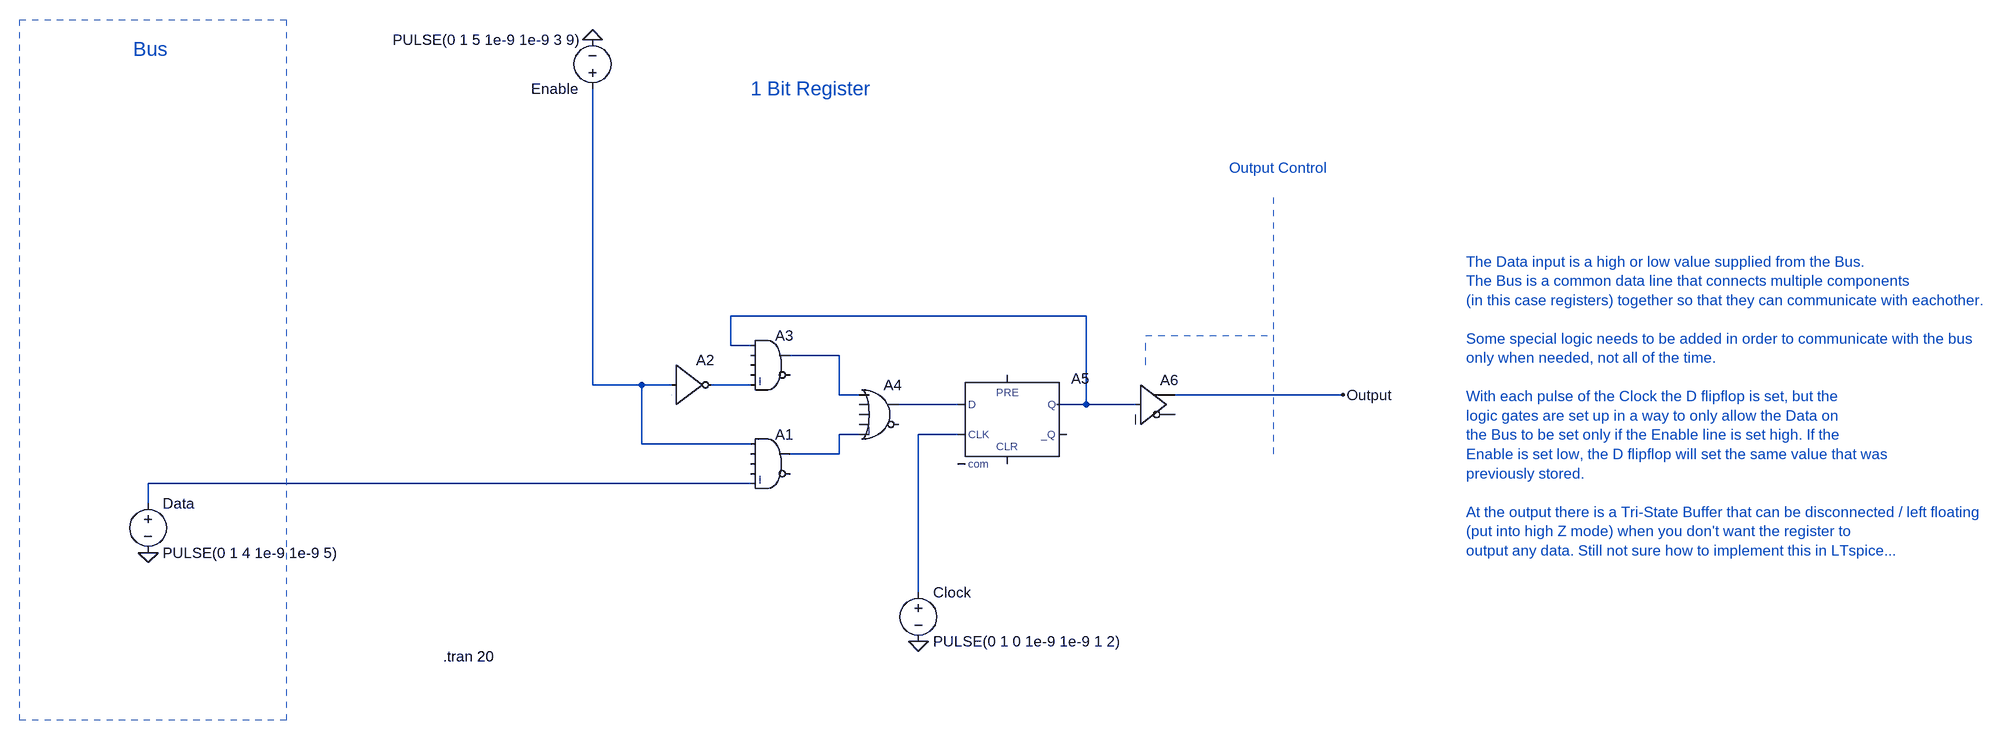
[diagram p0: schematic 1 Bit Register.asc]
1 Bit Register.asc, the LTspice schematic file:
Version 4
SHEET 1 3200 680
WIRE 976 -176 400 -176
WIRE 400 -128 400 -176
WIRE 432 -128 400 -128
WIRE 576 -112 496 -112
WIRE 176 -64 176 -544
WIRE 256 -64 176 -64
WIRE 304 -64 256 -64
WIRE 432 -64 368 -64
WIRE 576 -48 576 -112
WIRE 608 -48 576 -48
WIRE 1392 -48 1120 -48
WIRE 768 -32 672 -32
WIRE 976 -32 976 -176
WIRE 976 -32 928 -32
WIRE 1056 -32 976 -32
WIRE 608 16 576 16
WIRE 768 16 704 16
WIRE 256 32 256 -64
WIRE 432 32 256 32
WIRE 576 48 576 16
WIRE 576 48 496 48
WIRE 432 96 -544 96
WIRE -544 128 -544 96
WIRE 704 272 704 16
FLAG -544 208 0
FLAG 704 352 0
FLAG 176 -624 0
FLAG 1392 -48 Output
SYMBOL voltage -544 112 R0
WINDOW 123 0 0 Left 0
WINDOW 39 0 0 Left 0
SYMATTR InstName Data
SYMATTR Value PULSE(0 1 4 1e-9 1e-9 5)
SYMBOL voltage 176 -528 R180
WINDOW 123 0 0 Left 0
WINDOW 39 0 0 Left 0
SYMATTR InstName Enable
SYMATTR Value PULSE(0 1 5 1e-9 1e-9 3 9)
SYMBOL Digital\\and 464 0 R0
SYMATTR InstName A1
SYMBOL Digital\\inv 304 -128 R0
SYMATTR InstName A2
SYMBOL Digital\\and 464 -160 R0
SYMATTR InstName A3
SYMBOL Digital\\or 640 -80 R0
SYMATTR InstName A4
SYMBOL Digital\\dflop 848 -80 R0
SYMATTR InstName A5
SYMBOL voltage 704 256 R0
WINDOW 123 0 0 Left 0
WINDOW 39 0 0 Left 0
SYMATTR InstName Clock
SYMATTR Value PULSE(0 1 0 1e-9 1e-9 1 2)
SYMBOL Digital\\buf 1056 -96 R0
SYMATTR InstName A6
TEXT -66 376 Left 2 !.tran 20
TEXT 432 -544 Left 3 ;1 Bit Register
TEXT 1592 -264 Left 2 ;The Data input is a high or low value supplied from the Bus.\nThe Bus is a common data line that connects multiple components\n(in this case registers) together so that they can communicate with eachother.\n \nSome special logic needs to be added in order to communicate with the bus\nonly when needed, not all of the time. \n \nWith each pulse of the Clock the D flipflop is set, but the \nlogic gates are set up in a way to only allow the Data on\nthe Bus to be set only if the Enable line is set high. If the\nEnable is set low, the D flipflop will set the same value that was\npreviously stored.\n \nAt the output there is a Tri-State Buffer that can be disconnected / left floating\n(put into high Z mode) when you don't want the register to\noutput any data. Still not sure how to implement this in LTspice...
TEXT -568 -608 Left 3 ;Bus
TEXT 1208 -416 Left 2 ;Output Control
LINE Normal 1280 48 1280 -368 1
LINE Normal 1072 -144 1280 -144 1
LINE Normal 1072 -96 1072 -144 1
RECTANGLE Normal -320 480 -752 -656 1

The netlist it stands for:
* 1 Bit Register.asc
V§Data N008 0 PULSE(0 1 4 1e-9 1e-9 5)
V§Enable N003 0 PULSE(0 1 5 1e-9 1e-9 3 9)
A1 N003 0 0 0 N008 0 N006 0 AND
A2 N003 0 0 0 0 N004 0 0 BUF
A3 N001 0 0 0 N004 0 N002 0 AND
A4 N002 0 0 0 N006 0 N005 0 OR
A5 N005 0 N007 0 0 0 N001 0 DFLOP
V§Clock N007 0 PULSE(0 1 0 1e-9 1e-9 1 2)
A6 N001 0 0 0 0 0 Output 0 BUF
.tran 20
* 1 Bit Register
* The Data input is a high or low value supplied from the Bus.
* The Bus is a common data line that connects multiple components
* (in this case registers) together so that they can communicate with eachother.
* Some special logic needs to be added in order to communicate with the bus
* only when needed, not all of the time.
* With each pulse of the Clock the D flipflop is set, but the
* logic gates are set up in a way to only allow the Data on
* the Bus to be set only if the Enable line is set high. If the
* Enable is set low, the D flipflop will set the same value that was
* previously stored.
* At the output there is a Tri-State Buffer that can be disconnected / left floating
* (put into high Z mode) when you don't want the register to
* output any data. Still not sure how to implement this in LTspice...
* Bus
* Output Control
.backanno
.end